# Altium schematic sheet TopLevel.SchDoc
size A4; DocumentNumber: 1; SheetNumber: 1; SheetTotal: 4
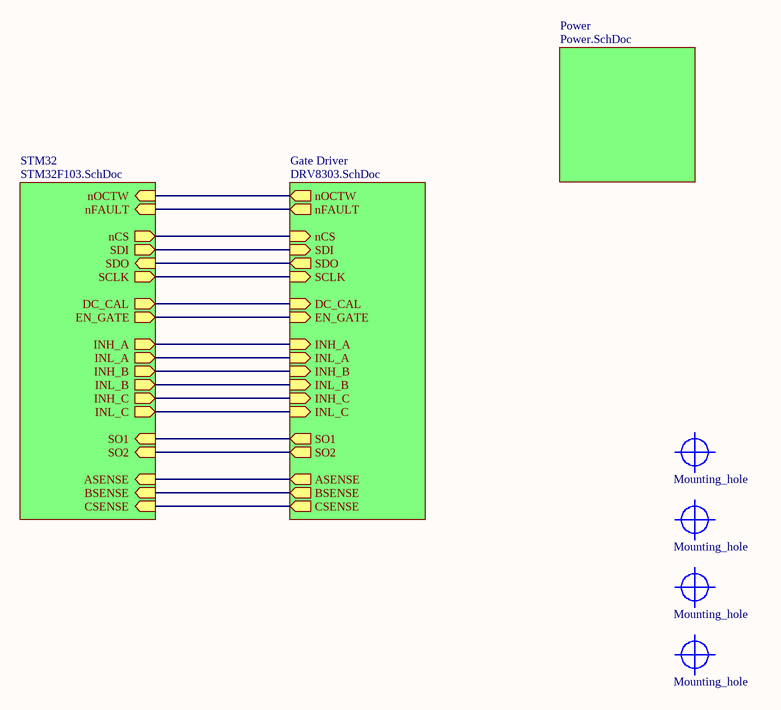
[diagram p0: TopLevel.SchDoc]

## Parts
M1  Mounting_hole  [M3_drill]
M2  Mounting_hole  [M3_drill]
M3  Mounting_hole  [M3_drill]
M4  Mounting_hole  [M3_drill]

## Sub-sheets
Gate Driver = DRV8303.SchDoc: nOCTW (out), nCS (in), SDI (in), nFAULT (out), SDO (out), SCLK (in), DC_CAL (in), EN_GATE (in), INH_A (in), INL_A (in), INH_B (in), INL_B (in), INH_C (in), INL_C (in), SO1 (out), SO2 (out), CSENSE (out), ASENSE (out), BSENSE (out)
Power = Power.SchDoc: no entries
STM32 = STM32F103.SchDoc: nOCTW (in), nCS (out), SDI (out), nFAULT (in), SDO (in), SCLK (out), DC_CAL (out), EN_GATE (out), INH_A (out), INL_A (out), INH_B (out), INL_B (out), INH_C (out), INL_C (out), SO1 (in), SO2 (in), ASENSE (in), BSENSE (in), CSENSE (in)

## Nets
(unnamed): sheet STM32/nOCTW, sheet Gate Driver/nOCTW
(unnamed): sheet STM32/nCS, sheet Gate Driver/nCS
(unnamed): sheet STM32/SDI, sheet Gate Driver/SDI
(unnamed): sheet STM32/nFAULT, sheet Gate Driver/nFAULT
(unnamed): sheet STM32/SDO, sheet Gate Driver/SDO
(unnamed): sheet STM32/SCLK, sheet Gate Driver/SCLK
(unnamed): sheet STM32/DC_CAL, sheet Gate Driver/DC_CAL
(unnamed): sheet STM32/EN_GATE, sheet Gate Driver/EN_GATE
(unnamed): sheet STM32/INH_A, sheet Gate Driver/INH_A
(unnamed): sheet STM32/INL_A, sheet Gate Driver/INL_A
(unnamed): sheet STM32/INH_B, sheet Gate Driver/INH_B
(unnamed): sheet STM32/INL_B, sheet Gate Driver/INL_B
(unnamed): sheet STM32/INH_C, sheet Gate Driver/INH_C
(unnamed): sheet STM32/INL_C, sheet Gate Driver/INL_C
(unnamed): sheet STM32/SO1, sheet Gate Driver/SO1
(unnamed): sheet STM32/SO2, sheet Gate Driver/SO2
(unnamed): sheet STM32/ASENSE, sheet Gate Driver/ASENSE
(unnamed): sheet STM32/BSENSE, sheet Gate Driver/BSENSE
(unnamed): sheet STM32/CSENSE, sheet Gate Driver/CSENSE